# Altium project PROC091F.PrjPcb (part 1 of 6)
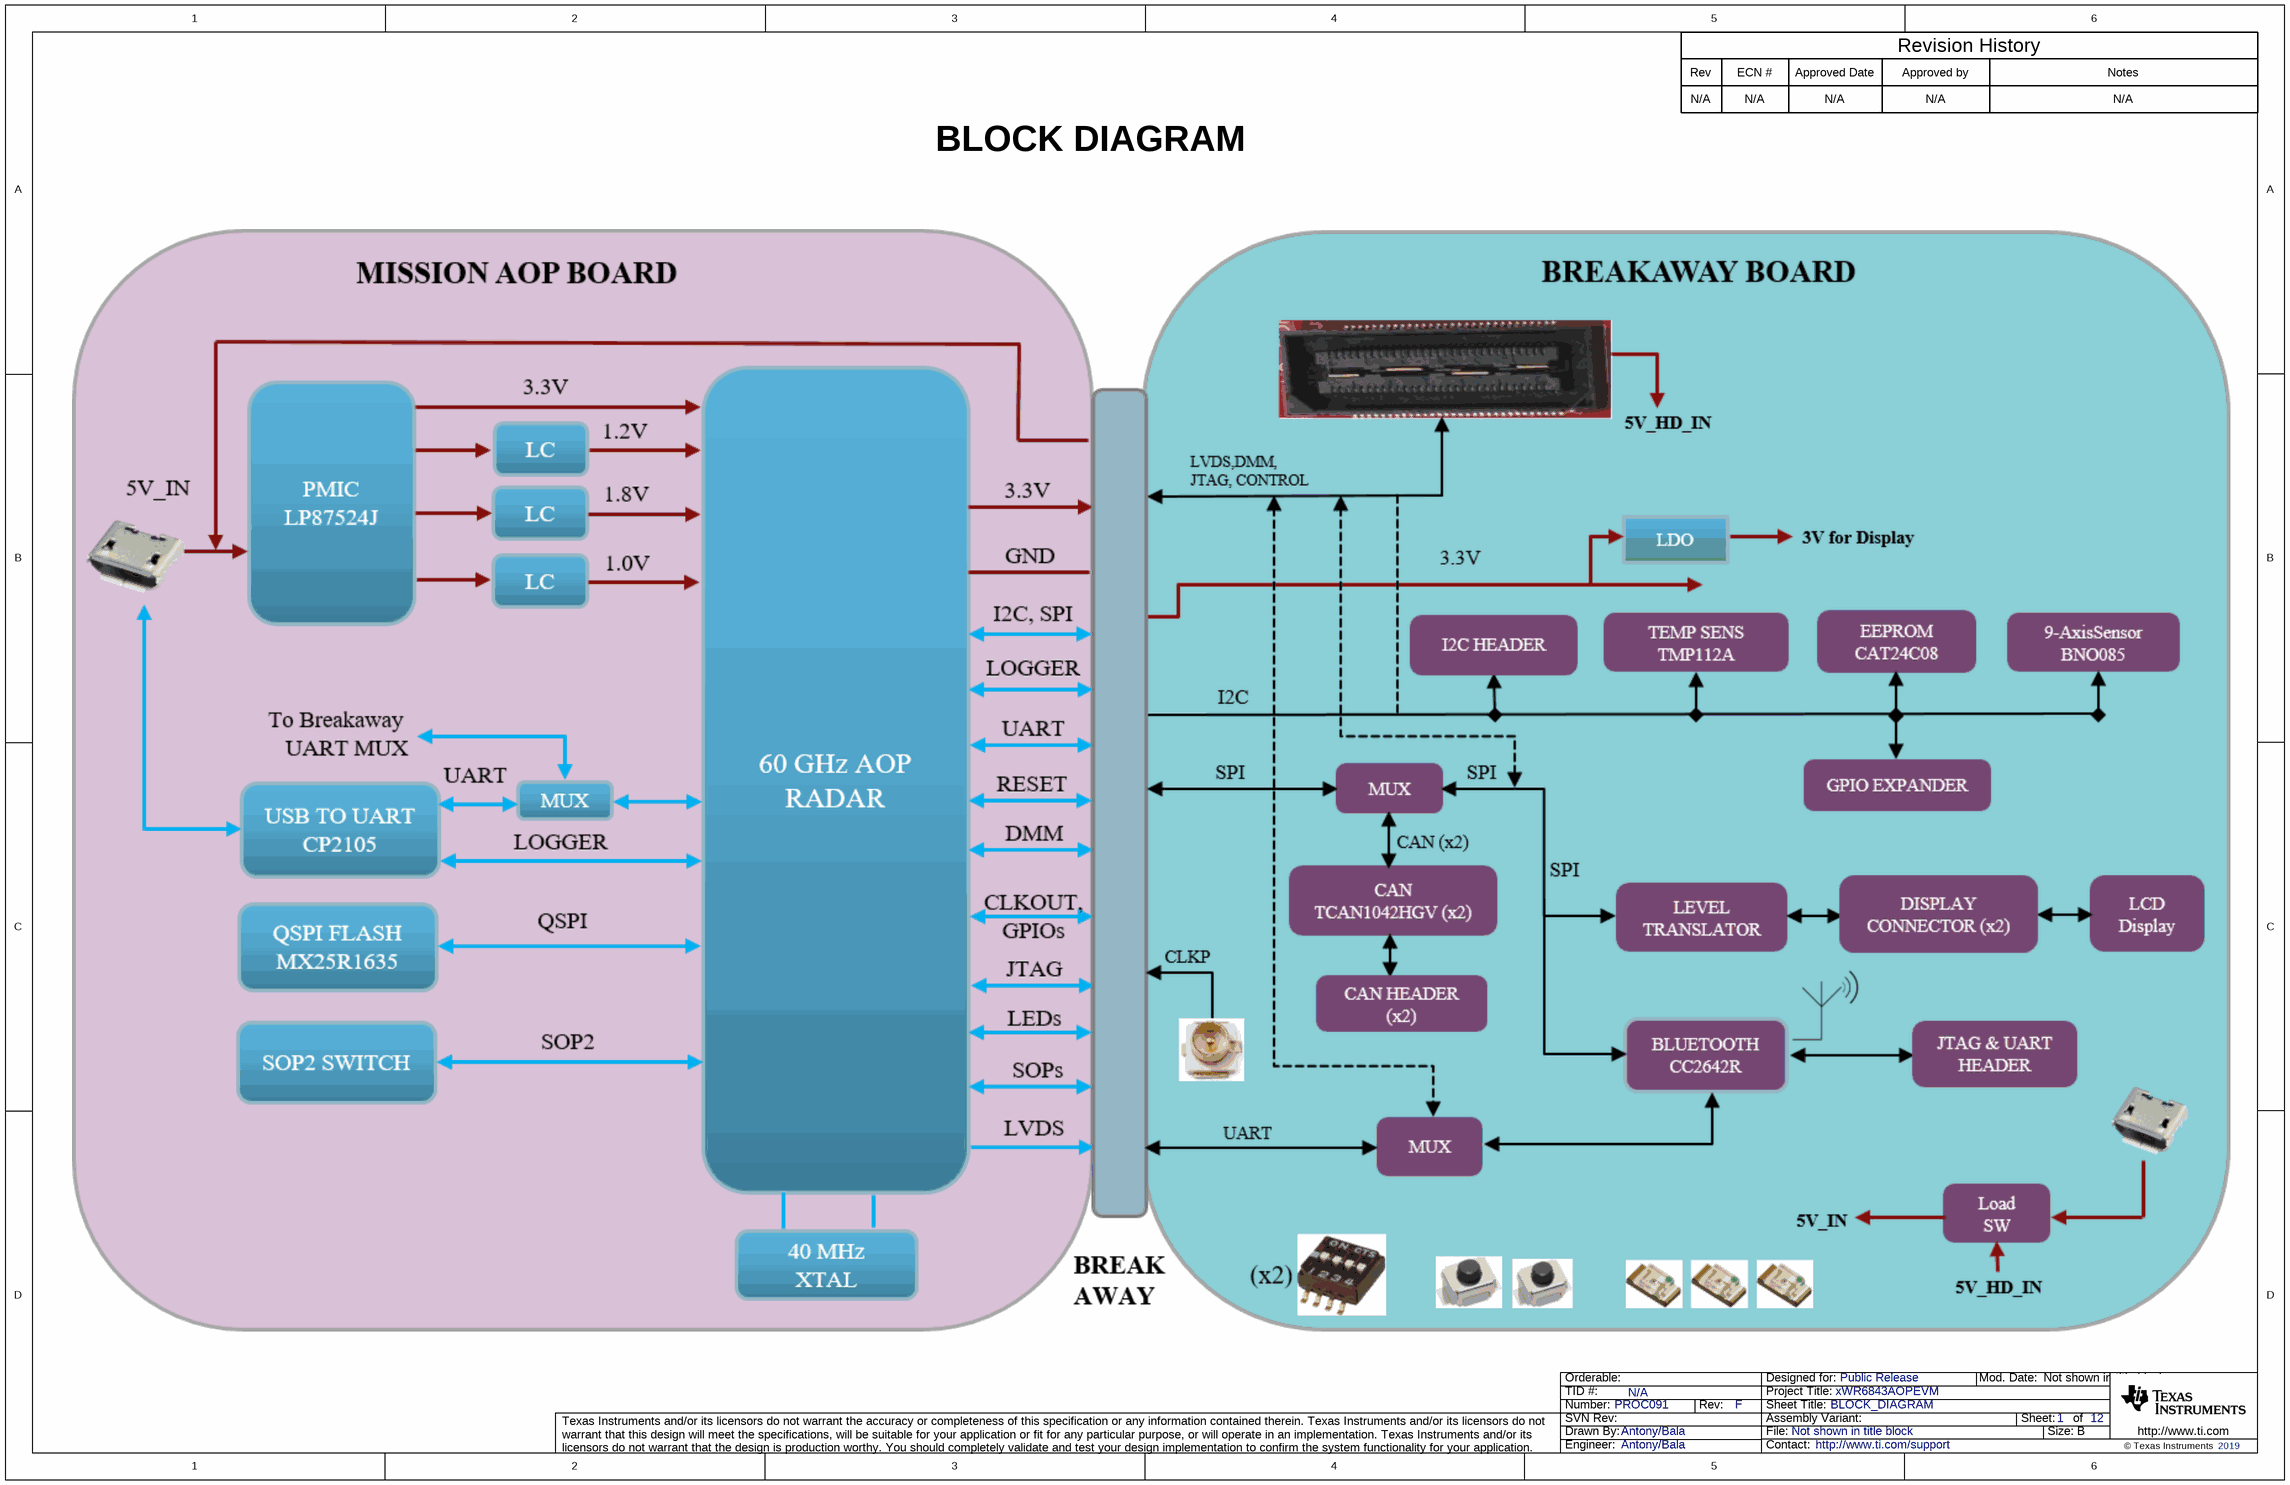
[diagram p0: PROC091F_BLOCK_DIAGRAM.SchDoc]
CopyrightYear: 2019; PCB_Layout: Mistral Team; PCB_Rev: F; PRJ_Customer: Public Release; PRJ_Engineer: Antony/Bala; PRJ_Number: PROC091; PRJ_Title: xWR6843AOPEVM; SCH_Rev: F; TechSupport: http://www.ti.com/support; TID: N/A
12 sheets, 414 parts. Net scope: flat (ports and power ports of the same name join across sheets).
Board file: PROC091F.PcbDoc
Sheets:
  PROC091F_BLOCK_DIAGRAM.SchDoc
  PROC091F_TABLEOFCONTENTS.SchDoc
  PROC091F_AOP_IO.SchDoc
  PROC091F_AOP_PWR.SchDoc
  PROC091F_PMIC.SchDoc
  PROC091F_FLASH_USB_TO_UART.SchDoc
  PROC091F_HD_CONN_PWR_SW.SchDoc
  PROC091F_RST_GPIOs_I2C.SchDoc
  PROC091F_BT_DISPLAY.SchDoc
  PROC091F_ANALOG_MUX.SchDoc
  PROC091F_CAN_INTERFACE.SchDoc
  PROC091F_Hardware.schdoc

## Sheet PROC091F_BLOCK_DIAGRAM.SchDoc: BLOCK_DIAGRAM
size 431 x 279 mm; Date: Not shown in title block; ApprovedBy: Not shown in title block; CheckedBy: Not shown in title block; Author: Not shown in title block; CompanyName: Not shown in title block; DrawnBy: Antony/Bala; Engineer: Not shown in title block; Organization: Not shown in title block; Address1: Not shown in title block; Address2: Not shown in title block; Address3: Not shown in title block; Address4: Not shown in title block; DocumentNumber: 1; Revision: Use project parameter SCH_Rev; SheetNumber: 1; SheetTotal: 12; PageSetup: Record=PageOptions|CenterHorizontal=True|CenterVertical=True|PrintScale=1.00|XCorrection=1.00|YCorrection=1.00|PrintKind=0|BorderSize=5000000|LeftOffset=0|BottomOffset=0|Orientation=2|PaperLength=1000|PaperWidth=1000|Scale=100|PaperSource=15|PrintQuality=600|MediaType=1|DitherType=10|PaperKind=Letter|PrintScaleMode=1; CurrentTime: Not shown in title block; CurrentDate: Not shown in title block; Time: Not shown in title block; DocumentFullPathAndName: Not shown in title block; DocumentName: Not shown in title block; ModifiedDate: Not shown in title block; ImagePath: Not shown in title block

### Notes on the sheet
- Rev
- N/A
- ECN #
- Approved Date
- Approved by
- Revision History
- Notes
- BLOCK DIAGRAM
- Drawn By:
- SVN Rev:
- Number:
- TID #:
- Orderable:
- Rev:
- Sheet Title:
- File:
- Project Title:
- Designed for:
- Assembly Variant:
- Mod. Date:
- Sheet:
- Size:
- of
- B
- http://www.ti.com
- Texas Instruments and/or its licensors do not warrant the accuracy or completeness of this specification or any information contained therein. Texas Instruments and/or its licensors do not warrant that this design will meet the specifications, will be suitable for your application or fit for any particular purpose, or will operate in an implementation. Texas Instruments and/or its licensors do not warrant that the design is production worthy. You should completely validate and test your design implementation to confirm the system functionality for your application.
- Engineer:
- Contact:
- © Texas Instruments

## Sheet PROC091F_TABLEOFCONTENTS.SchDoc: TABLE_OF_CONTENTS
size 431 x 279 mm; Date: Not shown in title block; ApprovedBy: Not shown in title block; CheckedBy: Not shown in title block; Author: Not shown in title block; CompanyName: Not shown in title block; DrawnBy: Antony/Bala; Engineer: Not shown in title block; Organization: Not shown in title block; Address1: Not shown in title block; Address2: Not shown in title block; Address3: Not shown in title block; Address4: Not shown in title block; DocumentNumber: 2; Revision: Use project parameter SCH_Rev; SheetNumber: 2; SheetTotal: 12; PageSetup: Record=PageOptions|CenterHorizontal=True|CenterVertical=True|PrintScale=1.00|XCorrection=1.00|YCorrection=1.00|PrintKind=0|BorderSize=5000000|LeftOffset=0|BottomOffset=0|Orientation=2|PaperLength=1000|PaperWidth=1000|Scale=100|PaperSource=15|PrintQuality=600|MediaType=1|DitherType=10|PaperKind=Letter|PrintScaleMode=1; CurrentTime: Not shown in title block; CurrentDate: Not shown in title block; Time: Not shown in title block; DocumentFullPathAndName: Not shown in title block; DocumentName: Not shown in title block; ModifiedDate: Not shown in title block; ImagePath: Not shown in title block
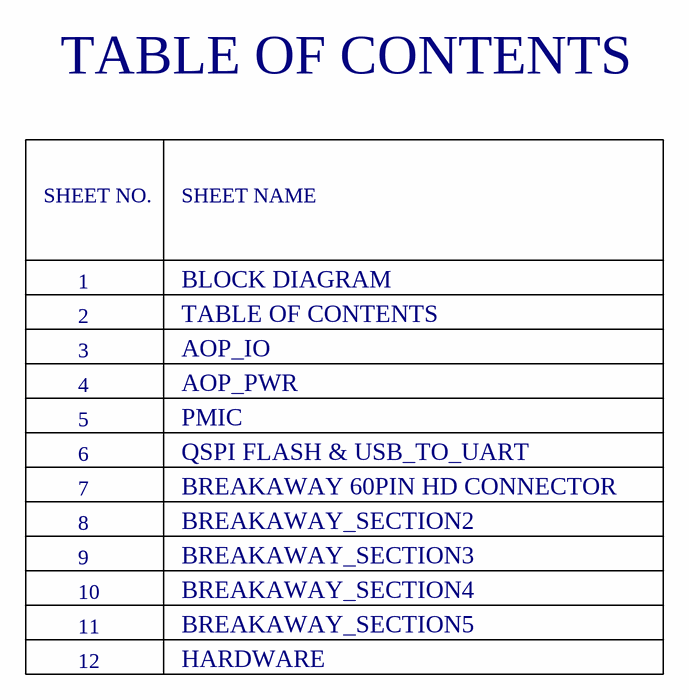
[diagram p1: PROC091F_TABLEOFCONTENTS.SchDoc]

### Notes on the sheet
- TABLE OF CONTENTS
- SHEET NO.
- SHEET NAME
- 1
- 2
- 3
- BLOCK DIAGRAM
- AOP_IO
- 4
- 5
- AOP_PWR
- PMIC
- 7
- 8
- 6
- QSPI FLASH & USB_TO_UART
- BREAKAWAY 60PIN HD CONNECTOR
- BREAKAWAY_SECTION2
- 9
- 10
- BREAKAWAY_SECTION3
- BREAKAWAY_SECTION4
- 11
- 12
- HARDWARE
- BREAKAWAY_SECTION5
- Drawn By:
- SVN Rev:
- Number:
- TID #:
- Orderable:
- Rev:
- Sheet Title:
- File:
- Project Title:
- Designed for:
- Assembly Variant:
- Mod. Date:
- Sheet:
- Size:
- of
- B
- http://www.ti.com
- Texas Instruments and/or its licensors do not warrant the accuracy or completeness of this specification or any information contained therein. Texas Instruments and/or its licensors do not warrant that this design will meet the specifications, will be suitable for your application or fit for any particular purpose, or will operate in an implementation. Texas Instruments and/or its licensors do not warrant that the design is production worthy. You should completely validate and test your design implementation to confirm the system functionality for your application.
- Engineer:
- Contact:
- © Texas Instruments

## Sheet PROC091F_AOP_IO.SchDoc: AOP_IO
size 431 x 279 mm; Date: Not shown in title block; ApprovedBy: Not shown in title block; CheckedBy: Not shown in title block; Author: Not shown in title block; CompanyName: Not shown in title block; DrawnBy: Antony/Bala; Engineer: Not shown in title block; Organization: Not shown in title block; Address1: Not shown in title block; Address2: Not shown in title block; Address3: Not shown in title block; Address4: Not shown in title block; DocumentNumber: 3; Revision: Use project parameter SCH_Rev; SheetNumber: 3; SheetTotal: 12; PageSetup: Record=PageOptions|CenterHorizontal=True|CenterVertical=True|PrintScale=1.00|XCorrection=1.00|YCorrection=1.00|PrintKind=0|BorderSize=5000000|LeftOffset=0|BottomOffset=0|Orientation=2|PaperLength=1000|PaperWidth=1000|Scale=100|PaperSource=15|PrintQuality=600|MediaType=1|DitherType=10|PaperKind=Letter|PrintScaleMode=1; CurrentTime: Not shown in title block; CurrentDate: Not shown in title block; Time: Not shown in title block; DocumentFullPathAndName: Not shown in title block; DocumentName: Not shown in title block; ModifiedDate: Not shown in title block; ImagePath: Not shown in title block
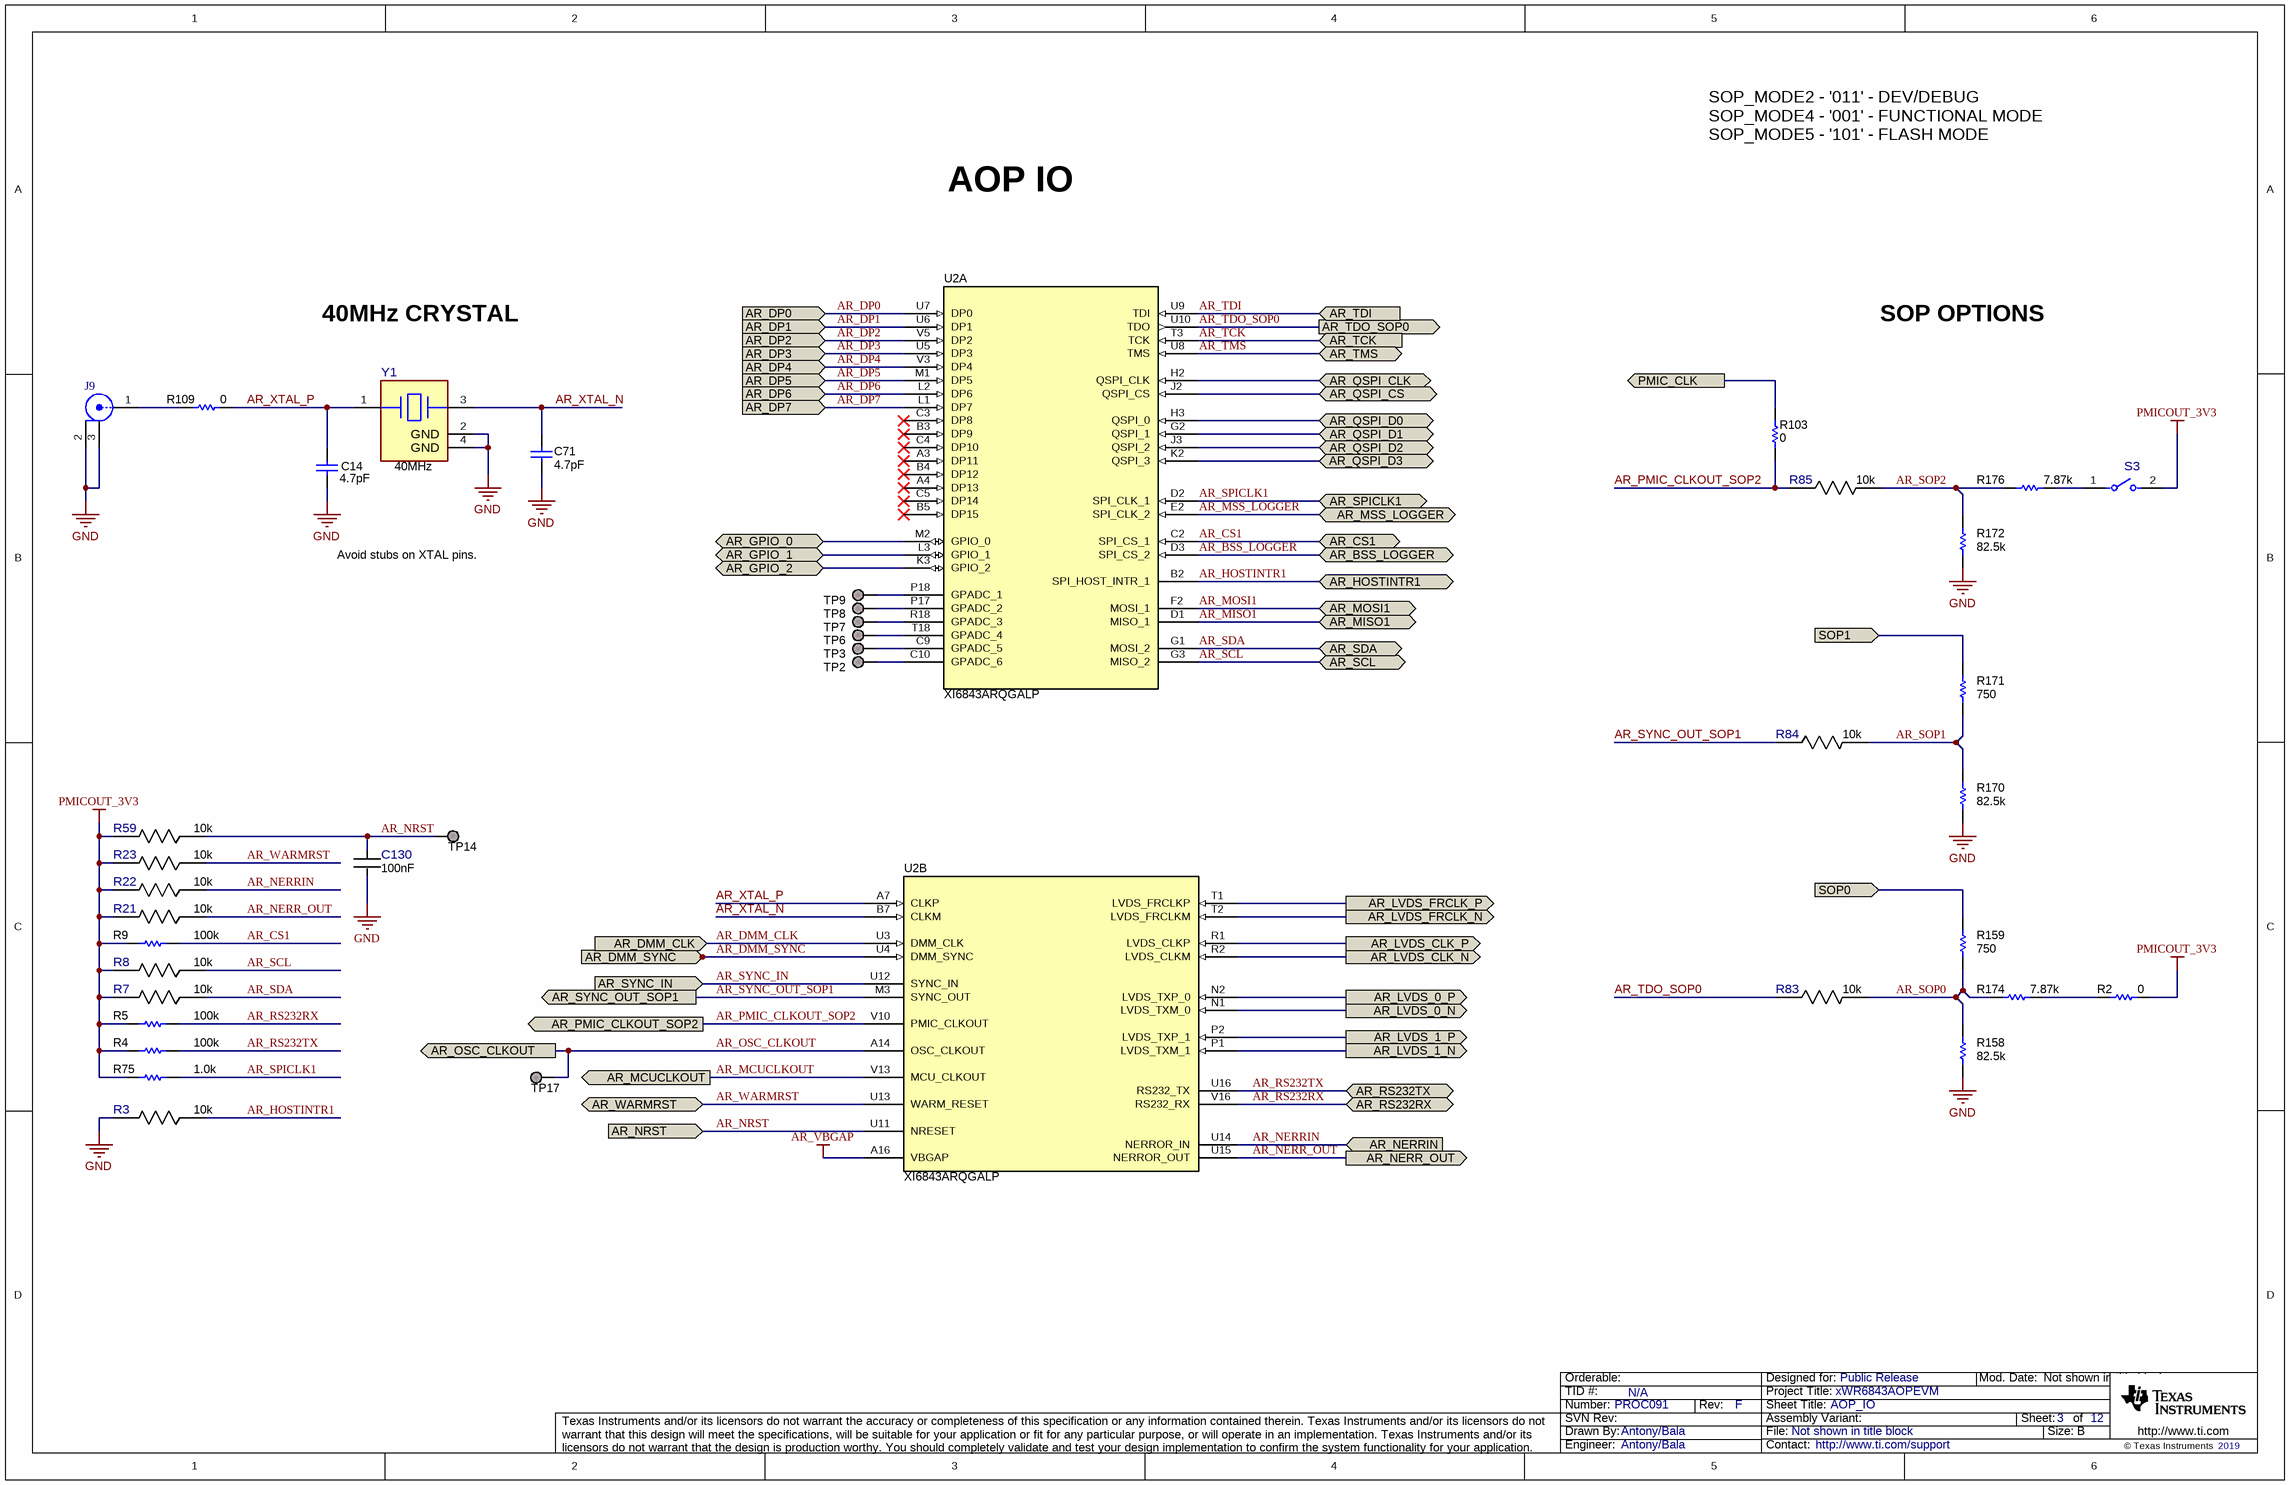
[diagram p2: PROC091F_AOP_IO.SchDoc]

### Parts
C14  value 4.7pF  [0201_033L]  (hidden comment: GRM0335C1H4R7BA01D)
C71  value 4.7pF  [0201_033L]  (hidden comment: GRM0335C1H4R7BA01D)
C130  Cap_F: 100nF  [FP-GRM033R6YA104KE14D_0201 (0603 Metric)-IPC_C]  (hidden comment: GRM033R6YA104KE14D)
J9  U.FL-R-SMT-1(01)  [CONN_UFL-R-SMT-1]  (value not drawn)
R2  Res_ohm: 0  [FP-RC0201JR-070RL_0201 (0603 Metric)-MFG]  (hidden comment: RC0201JR-070RL)
R3  Res_ohm: 10k  [FP-RR0306P-103-D_0201-IPC_C]  (hidden comment: RR0306P-103-D)
R4  value 100k  [0201L]  (hidden comment: CRCW0201100KFKED)
R5  value 100k  [0201L]  (hidden comment: CRCW0201100KFKED)
R7  Res_ohm: 10k  [FP-RR0306P-103-D_0201-IPC_C]  (hidden comment: RR0306P-103-D)
R8  Res_ohm: 10k  [FP-RR0306P-103-D_0201-IPC_C]  (hidden comment: RR0306P-103-D)
R9  value 100k  [0201L]  (hidden comment: CRCW0201100KFKED)
R21  Res_ohm: 10k  [FP-RR0306P-103-D_0201-IPC_C]  (hidden comment: RR0306P-103-D)
R22  Res_ohm: 10k  [FP-RR0306P-103-D_0201-IPC_C]  (hidden comment: RR0306P-103-D)
R23  Res_ohm: 10k  [FP-RR0306P-103-D_0201-IPC_C]  (hidden comment: RR0306P-103-D)
R59  Res_ohm: 10k  [FP-RR0306P-103-D_0201-IPC_C]  (hidden comment: RR0306P-103-D)
R75  value 1.0k  [0201L]  (hidden comment: RC0201JR-071KL)
R83  Res_ohm: 10k  [FP-RR0306P-103-D_0201-IPC_C]  (hidden comment: RR0306P-103-D)
R84  Res_ohm: 10k  [FP-RR0306P-103-D_0201-IPC_C]  (hidden comment: RR0306P-103-D)
R85  Res_ohm: 10k  [FP-RR0306P-103-D_0201-IPC_C]  (hidden comment: RR0306P-103-D)
R103  Res_ohm: 0  [FP-RC0201JR-070RL_0201 (0603 Metric)-IPC_C]  (hidden comment: RC0201JR-070RL)
R109  Res_ohm: 0  [FP-RC0201JR-070RL_0201 (0603 Metric)-MFG]  (hidden comment: RC0201JR-070RL)
R158  value 82.5k  [0201L]  (hidden comment: RC0201FR-0782K5L)
R159  value 750  [0201L]  (hidden comment: RC0201JR-07750RL)
R170  value 82.5k  [0201L]  (hidden comment: RC0201FR-0782K5L)
R171  value 750  [0201L]  (hidden comment: RC0201JR-07750RL)
R172  value 82.5k  [0201L]  (hidden comment: RC0201FR-0782K5L)
R174  value 7.87k  [0201L]  (hidden comment: RC0201FR-077K87L)
R176  value 7.87k  [0201L]  (hidden comment: RC0201FR-077K87L)
S3  CHS-01TA  [FP-CHS-01TA_SMT_SW_5MM4_2MM5-MFG]  (value not drawn)
TP2  TESTPOINT  [TP_25MIL-SMT]  (value not drawn)  (no BOM)
TP3  TESTPOINT  [TP_25MIL-SMT]  (value not drawn)  (no BOM)
TP6  TESTPOINT  [TP_25MIL-SMT]  (value not drawn)  (no BOM)
TP7  TESTPOINT  [TP_25MIL-SMT]  (value not drawn)  (no BOM)
TP8  TESTPOINT  [TP_25MIL-SMT]  (value not drawn)  (no BOM)
TP9  TESTPOINT  [TP_25MIL-SMT]  (value not drawn)  (no BOM)
TP14  TESTPOINT  [TP_25MIL-SMT]  (value not drawn)  (no BOM)
TP17  TESTPOINT  [TP_25MIL-SMT]  (value not drawn)  (no BOM)
U2  XI6843ARQGALP  [ALP0180A]  (parts A,B of 4)
Y1  Frequency_Fixed: 40MHz  [FP-CX2016DB40000D0FLJCC_SMT_2MM0_1MM6-MFG]  (hidden comment: CX2016DB40000D0FLJCC)

### Ports
AR_BSS_LOGGER (bidir), AR_CS1 (bidir), AR_DMM_CLK (in), AR_DMM_SYNC (in), AR_DP0 (in), AR_DP1 (in), AR_DP2 (in), AR_DP3 (in), AR_DP4 (in), AR_DP5 (in), AR_DP6 (in), AR_DP7 (in), AR_GPIO_0 (bidir), AR_GPIO_1 (bidir), AR_GPIO_2 (bidir), AR_HOSTINTR1 (bidir), AR_LVDS_0_N (out), AR_LVDS_0_P (out), AR_LVDS_1_N (out), AR_LVDS_1_P (out), AR_LVDS_CLK_N (out), AR_LVDS_CLK_P (out), AR_LVDS_FRCLK_N (out), AR_LVDS_FRCLK_P (out), AR_MCUCLKOUT (out), AR_MISO1 (bidir), AR_MOSI1 (bidir), AR_MSS_LOGGER (bidir), AR_NERR_OUT (out), AR_NERRIN (in), AR_NRST (in), AR_OSC_CLKOUT (out), AR_PMIC_CLKOUT_SOP2 (out), AR_QSPI_CLK (bidir), AR_QSPI_CS (bidir), AR_QSPI_D0 (bidir), AR_QSPI_D1 (bidir), AR_QSPI_D2 (bidir), AR_QSPI_D3 (bidir), AR_RS232RX (bidir), AR_RS232TX (bidir), AR_SCL (bidir), AR_SDA (bidir), AR_SPICLK1 (bidir), AR_SYNC_IN (in), AR_SYNC_OUT_SOP1 (out), AR_TCK (in), AR_TDI (in), AR_TDO_SOP0 (out), AR_TMS (bidir), AR_WARMRST (bidir), PMIC_CLK (out), SOP0 (in), SOP1 (in)

### Nets
AR_VBGAP: U2.A16(VBGAP)
GND: C14.1 C71.1 C130.2 J9.2 J9.3 R3.2 R158.1 R170.1 R172.1 Y1.2(GND) Y1.4(GND)
PMICOUT_3V3: R2.1 R4.1 R5.1 R7.2 R8.2 R9.1 R21.2 R22.2 R23.2 R59.2 R75.1 S3.2
AR_BSS_LOGGER: U2.D3(SPI_CS_2) ; port AR_BSS_LOGGER
AR_CS1: R9.2 U2.C2(SPI_CS_1) ; port AR_CS1
AR_DMM_CLK: U2.U3(DMM_CLK) ; port AR_DMM_CLK
AR_DMM_SYNC: U2.U4(DMM_SYNC) ; port AR_DMM_SYNC
AR_DP0: U2.U7(DP0) ; port AR_DP0
AR_DP1: U2.U6(DP1) ; port AR_DP1
AR_DP2: U2.V5(DP2) ; port AR_DP2
AR_DP3: U2.U5(DP3) ; port AR_DP3
AR_DP4: U2.V3(DP4) ; port AR_DP4
AR_DP5: U2.M1(DP5) ; port AR_DP5
AR_DP6: U2.L2(DP6) ; port AR_DP6
AR_DP7: U2.L1(DP7) ; port AR_DP7
AR_GPIO_0: U2.M2(GPIO_0) ; port AR_GPIO_0
AR_GPIO_1: U2.L3(GPIO_1) ; port AR_GPIO_1
AR_GPIO_2: U2.K3(GPIO_2) ; port AR_GPIO_2
AR_HOSTINTR1: R3.1 U2.B2(SPI_HOST_INTR_1) ; port AR_HOSTINTR1
AR_LVDS_0_N: U2.N1(LVDS_TXM_0) ; port AR_LVDS_0_N
AR_LVDS_0_P: U2.N2(LVDS_TXP_0) ; port AR_LVDS_0_P
AR_LVDS_1_N: U2.P1(LVDS_TXM_1) ; port AR_LVDS_1_N
AR_LVDS_1_P: U2.P2(LVDS_TXP_1) ; port AR_LVDS_1_P
AR_LVDS_CLK_N: U2.R2(LVDS_CLKM) ; port AR_LVDS_CLK_N
AR_LVDS_CLK_P: U2.R1(LVDS_CLKP) ; port AR_LVDS_CLK_P
AR_LVDS_FRCLK_N: U2.T2(LVDS_FRCLKM) ; port AR_LVDS_FRCLK_N
AR_LVDS_FRCLK_P: U2.T1(LVDS_FRCLKP) ; port AR_LVDS_FRCLK_P
AR_MCUCLKOUT: U2.V13(MCU_CLKOUT) ; port AR_MCUCLKOUT
AR_MISO1: U2.D1(MISO_1) ; port AR_MISO1
AR_MOSI1: U2.F2(MOSI_1) ; port AR_MOSI1
AR_MSS_LOGGER: U2.E2(SPI_CLK_2) ; port AR_MSS_LOGGER
AR_NERR_OUT: R21.1 U2.U15(NERROR_OUT) ; port AR_NERR_OUT
AR_NERRIN: R22.1 U2.U14(NERROR_IN) ; port AR_NERRIN
AR_NRST: C130.1 R59.1 TP14.1 U2.U11(NRESET) ; port AR_NRST
AR_OSC_CLKOUT: TP17.1 U2.A14(OSC_CLKOUT) ; port AR_OSC_CLKOUT
AR_PMIC_CLKOUT_SOP2: R85.1 R103.1 U2.V10(PMIC_CLKOUT) ; port AR_PMIC_CLKOUT_SOP2
AR_QSPI_CLK: U2.H2(QSPI_CLK) ; port AR_QSPI_CLK
AR_QSPI_CS: U2.J2(QSPI_CS) ; port AR_QSPI_CS
AR_QSPI_D0: U2.H3(QSPI_0) ; port AR_QSPI_D0
AR_QSPI_D1: U2.G2(QSPI_1) ; port AR_QSPI_D1
AR_QSPI_D2: U2.J3(QSPI_2) ; port AR_QSPI_D2
AR_QSPI_D3: U2.K2(QSPI_3) ; port AR_QSPI_D3
AR_RS232RX: R5.2 U2.V16(RS232_RX) ; port AR_RS232RX
AR_RS232TX: R4.2 U2.U16(RS232_TX) ; port AR_RS232TX
AR_SCL: R8.1 U2.G3(MISO_2) ; port AR_SCL
AR_SDA: R7.1 U2.G1(MOSI_2) ; port AR_SDA
AR_SOP0: R83.2 R158.2 R159.1 R174.2
AR_SOP1: R84.2 R170.2 R171.1
AR_SOP2: R85.2 R172.2 R176.2
AR_SPICLK1: R75.2 U2.D2(SPI_CLK_1) ; port AR_SPICLK1
AR_SYNC_IN: U2.U12(SYNC_IN) ; port AR_SYNC_IN
AR_SYNC_OUT_SOP1: R84.1 U2.M3(SYNC_OUT) ; port AR_SYNC_OUT_SOP1
AR_TCK: U2.T3(TCK) ; port AR_TCK
AR_TDI: U2.U9(TDI) ; port AR_TDI
AR_TDO_SOP0: R83.1 U2.U10(TDO) ; port AR_TDO_SOP0
AR_TMS: U2.U8(TMS) ; port AR_TMS
AR_WARMRST: R23.1 U2.U13(WARM_RESET) ; port AR_WARMRST
AR_XTAL_N: C71.2 U2.B7(CLKM) Y1.3
AR_XTAL_P: C14.2 R109.1 U2.A7(CLKP) Y1.1
PMIC_CLK: R103.2 ; port PMIC_CLK
SOP0: R159.2 ; port SOP0
SOP1: R171.2 ; port SOP1
NetJ9_1: J9.1 R109.2
NetR2_2: R2.2 R174.1
NetR176_1: R176.1 S3.1
NetTP2_1: TP2.1 U2.C10(GPADC_6)
NetTP3_1: TP3.1 U2.C9(GPADC_5)
NetTP6_1: TP6.1 U2.T18(GPADC_4)
NetTP7_1: TP7.1 U2.R18(GPADC_3)
NetTP8_1: TP8.1 U2.P17(GPADC_2)
NetTP9_1: TP9.1 U2.P18(GPADC_1)

Not connected (* = marked no-connect by the designer): U2 A3(DP11)* A4(DP13)* B3(DP9)* B4(DP12)* B5(DP15)* C3(DP8)* C4(DP10)* C5(DP14)*

### Notes on the sheet
- SOP_MODE2 - '011' - DEV/DEBUG
  SOP_MODE4 - '001' - FUNCTIONAL MODE
  SOP_MODE5 - '101' - FLASH MODE
- AOP IO
- 40MHz CRYSTAL
- SOP OPTIONS
- Avoid stubs on XTAL pins.
- Drawn By:
- SVN Rev:
- Number:
- TID #:
- Orderable:
- Rev:
- Sheet Title:
- File:
- Project Title:
- Designed for:
- Assembly Variant:
- Mod. Date:
- Sheet:
- Size:
- of
- B
- http://www.ti.com
- Texas Instruments and/or its licensors do not warrant the accuracy or completeness of this specification or any information contained therein. Texas Instruments and/or its licensors do not warrant that this design will meet the specifications, will be suitable for your application or fit for any particular purpose, or will operate in an implementation. Texas Instruments and/or its licensors do not warrant that the design is production worthy. You should completely validate and test your design implementation to confirm the system functionality for your application.
- Engineer:
- Contact:
- © Texas Instruments

### Library data of the parts
C14 C71 = CMP-0080076-1: CAP, CERM, 4.7 pF, 50 V,+/- 3%, C0G/NP0, 0201; Manufacturer: MuRata; AEC Category: Q200; AEC Qualified: N; Cap_Case: 0201; SizeArea_mm2: 0.18; SizeAreaWB_mm2: 2.08; SizeX_mm: 0.6; SizeY_mm: 0.3; SizeZ_mm: 0.33; TaMax_C: 125°C; TaMin_C: -55°C; U/M: EA; Value2: 50V; RoHS: Y; AEC Grade: N/A; Cap_F: 4.7pF; ComponentLink1Description: Datasheet link; ComponentLink1URL: https://search.murata.co.jp/Ceramy/image/img/A01X/G101/ENG/GRM0335C1H4R7BA01-01A.pdf; CompType: Capacitor; MountType: SMT; PackageReference: 0201; PartNumber: GRM0335C1H4R7BA01D; Polarized: N; Supplier 1: Digi-Key; Supplier 2: Mouser; Supplier Part Number 1: 490-11332-1-ND; Supplier Part Number 2: 81-GRM0335C1H4R7BA1D; Technology: Ceramic; TempCo: C0G/NP0; Tolerance_%: 3%; ValueDisplayed: 4.7pF; VDC_V: 50V
C130 = CMP-0086440-1: Cap Ceramic 0.1uF 35V X5R 10% Pad SMD 0201 85C T/R; Manufacturer: Murata Electronics North America; AEC Qualified: No; SizeZ_mm: 0.33mm; Symbol Name: SYM-GRM033R6YA104KE14D; TempCo: 15%; RoHS: TRUE; ComponentLink1Description: Datasheet; ComponentLink1URL: https://search.murata.co.jp/Ceramy/image/img/A01X/G101/ENG/GRM033R6YA104KE14-01.pdf; PackageReference: 0201 (0603 Metric); PartNumber: GRM033R6YA104KE14D; Tolerance_%: 10%; VDC_V: 35V
J9 = CMP-0075320-1: Receptacle, Ultra Miniature Coaxial, Male Pin, 50 ohm, SMT; Manufacturer: Hirose Electric Co. Ltd.; CNHeader: False; Gender: Female; ContactFinish: Gold; ComponentLink1URL: https://www.hirose.com/product/en/download_file/key_name/U.FL%2DR%2DSMT%2D1%2801%29/category/Drawing%20(2D)/doc_file_id/37625/?file_category_id=6&item_id=03310472201&is_series=; Supplier Part Number 2: 18K7517; Publisher: Texas Instruments; Supplier 2: Newark; Supplier Part Number 3: 798-U.FL-R-SMT01; Color: Beige; Supplier 3: Mouser; RoHS: Y; MountType: SMT; Supplier 1: Digi-Key; PackageReference: Ultra small CO-AX SMD; PinCount: 3; CompType: Receptacle; LatestRevisionDate: 2017-07-12; PartNumber: U.FL-R-SMT-1(01); Orientation: Vertical; ComponentLink1Description: Datasheet URL; Supplier Part Number 1: H122041-ND; CT: False
R2 R103 R109 = CMP-0086442-2: RES SMD 0 OHM JUMPER 1/20W 0201; Manufacturer: Yageo; AEC Qualified: No; Power_W: 50mW; SizeZ_mm: 0.26mm; TempCo: 200ppm/°C; Tolerance_%: 5%; VDC_V: 25V; RoHS: TRUE; ComponentLink1Description: Datasheet; ComponentLink1URL: http://www.yageo.com/documents/recent/PYu-RC_Group_51_RoHS_L_10.pdf; PackageReference: 0201 (0603 Metric); PartNumber: RC0201JR-070RL; Technology: Thick Film
R3 R7 R8 R21-R23 R59 R83-R85 = CMP-0088002-1: 10 kOhms ±0.5% 0.05W, 1/20W Chip Resistor 0201 (0603 Metric)  Thin Film; Manufacturer: Susumu; AEC Qualified: No; Power_W: 50mW; SizeZ_mm: 0.26mm; Symbol Name: SYM-RR0306P-103-D; TempCo: 25ppm/°C; VDC_V: 15V; RoHS: TRUE; ComponentLink1Description: Datasheet; ComponentLink1URL: https://www.susumu.co.jp/common/pdf/n_catalog_partition05_en.pdf; PackageReference: 0201; PartNumber: RR0306P-103-D; Technology: Thin Film; Tolerance_%: 0.5%
R4 R5 R9 = CMP-0027261-3: RES, 100 k, 1%, 0.05 W, 0201; Manufacturer: Vishay-Dale; AEC Category: Q200; AEC Qualified: N; EIA_Code: E96; Power_W: 50mW; SizeArea_mm2: 0.18; SizeX_mm: 0.6; SizeY_mm: 0.3; SizeZ_mm: 0.26; TempCo: 100 ppm/C; Value2: 0.05W; VDC_V: 30V; RoHS: E; AEC Grade: N/A; ComponentLink1Description: Datasheet link; ComponentLink1URL: http://www.vishay.com/docs/20052/crcw0201e3.pdf; CompType: Resistor; MountType: SMT; PackageReference: 0201; PartNumber: CRCW0201100KFKED; Res_ohm: 100k; Supplier 1: Digi-Key; Supplier 2: Newark; Supplier 3: Mouser; Supplier Part Number 1: 541-100KAABCT-ND; Supplier Part Number 2: 84R1457; Supplier Part Number 3: 71-CRCW0201100KFKED; Technology: Thick Film; Tolerance_%: 1%; Value1: 1%; Value_Code: 100k; ValueDisplayed: 100k
R75 = CMP-0027052-1: RES, 1.0 k, 5%, 0.05 W, 0201; Manufacturer: Yageo America; AEC Category: Q200; AEC Qualified: N; EIA_Code: E24; Power_W: 50mW; Res_ohm: 1k; SizeArea_mm2: 0.18; SizeX_mm: 0.6; SizeY_mm: 0.3; SizeZ_mm: 0.26; TempCo: 200 ppm/C; U/M: EA; Value2: 0.05W; Value_Code: 1k00; VDC_V: 25V; RoHS: Y; AEC Grade: N/A; ComponentLink1Description: Datasheet link; ComponentLink1URL: http://www.yageo.com/documents/recent/PYu-RC_Group_51_RoHS_L_5.pdf; CompType: Resistor; LatestRevisionDate: 2017-03-09; MountType: SMT; PackageReference: 0201; PartNumber: RC0201JR-071KL; Published: 2016-10-14; Publisher: Texas Instruments; Supplier 1: Digi-Key; Supplier 2: Mouser; Supplier Part Number 1: 311-1KNCT-ND; Supplier Part Number 2: 603-RC0201JR-071KL; Technology: Thick Film; Tolerance_%: 5%; Value1: 5%; ValueDisplayed: 1.0k
R158 R170 R172 = CMP-0027891-1: RES, 82.5 k, 1%, 0.05 W, 0201; Manufacturer: Yageo America; AEC Category: Q200; AEC Qualified: N; EIA_Code: E96; Power_W: 50mW; SizeArea_mm2: 0.18; SizeX_mm: 0.6; SizeY_mm: 0.3; SizeZ_mm: 0.26; TempCo: 200 ppm/C; U/M: EA; Value2: 0.05W; Value_Code: 82k5; VDC_V: 25V; RoHS: Y; AEC Grade: N/A; ComponentLink1Description: Datasheet link; ComponentLink1URL: http://www.yageo.com/documents/recent/PYu-RC_Group_51_RoHS_L_5.pdf; CompType: Resistor; LatestRevisionDate: 2017-03-09; MountType: SMT; PackageReference: 0201; PartNumber: RC0201FR-0782K5L; Published: 2016-10-14; Publisher: Texas Instruments; Res_ohm: 82.5k; Supplier 1: Digi-Key; Supplier 2: Mouser; Supplier Part Number 1: YAG2815CT-ND; Supplier Part Number 2: 603-RC0201FR-0782K5L; Technology: Thick Film; Tolerance_%: 1%; Value1: 1%; ValueDisplayed: 82.5k
R159 R171 = CMP-0027165-1: RES, 750, 5%, 0.05 W, 0201; Manufacturer: Yageo America; AEC Category: Q200; AEC Qualified: N; EIA_Code: E24; Power_W: 50mW; SizeArea_mm2: 0.18; SizeX_mm: 0.6; SizeY_mm: 0.3; SizeZ_mm: 0.26; TempCo: 200 ppm/C; U/M: EA; Value2: 0.05W; Value_Code: 750R; VDC_V: 25V; RoHS: Y; AEC Grade: N/A; ComponentLink1Description: Datasheet link; ComponentLink1URL: http://www.yageo.com/documents/recent/PYu-RC_Group_51_RoHS_L_5.pdf; CompType: Resistor; LatestRevisionDate: 2017-03-09; MountType: SMT; PackageReference: 0201; PartNumber: RC0201JR-07750RL; Published: 2016-10-14; Publisher: Texas Instruments; Res_ohm: 750; Supplier 1: Digi-Key; Supplier 2: Mouser; Supplier Part Number 1: YAG2927CT-ND; Supplier Part Number 2: 603-RC0201JR-07750RL; Technology: Thick Film; Tolerance_%: 5%; Value1: 5%; ValueDisplayed: 750
R174 R176 = CMP-0027880-1: RES, 7.87 k, 1%, 0.05 W, 0201; Manufacturer: Yageo America; AEC Category: Q200; AEC Qualified: N; EIA_Code: E96; Power_W: 50mW; SizeArea_mm2: 0.18; SizeX_mm: 0.6; SizeY_mm: 0.3; SizeZ_mm: 0.26; TempCo: 200 ppm/C; U/M: EA; Value2: 0.05W; Value_Code: 7k87; VDC_V: 25V; RoHS: Y; AEC Grade: N/A; ComponentLink1Description: Datasheet link; ComponentLink1URL: http://www.yageo.com/documents/recent/PYu-RC_Group_51_RoHS_L_5.pdf; CompType: Resistor; LatestRevisionDate: 2017-03-09; MountType: SMT; PackageReference: 0201; PartNumber: RC0201FR-077K87L; Published: 2016-10-14; Publisher: Texas Instruments; Res_ohm: 7.87k; Supplier 1: Digi-Key; Supplier 2: Mouser; Supplier Part Number 1: YAG2807CT-ND; Supplier Part Number 2: 603-RC0201FR-077K87L; Technology: Thick Film; Tolerance_%: 1%; Value1: 1%; ValueDisplayed: 7.87k
S3 = CMP-0087181-1: SWITCH SLIDE DIP SPST 100MA 6V; Manufacturer: Nidec Copal Electronics; PositionCount: 1; SizeZ_mm: 2.5mm; Symbol Name: SYM-CHS-01TA; RoHS: TRUE; Circuit: SPST; ComponentLink1Description: Datasheet; ComponentLink1URL: https://www.nidec-copal-electronics.com/e/catalog/switch/chs.pdf; MountType: Surface Mount; PackageReference: SMT_SW_5MM4_2MM5; PartNumber: CHS-01TA; VDC_V: 6V
TP2 TP3 TP6-TP9 TP14 TP17 = CMP-0078143-3: TEST POINT.  No entry in BOM.; CompType: Testpoint; Manufacturer: N/A; PackageReference: N/A; PartNumber: N/A; Library Reference: TESTPOINT
U2 = CMP-0860942-2: XI6843ARQGALP, ALP0180A (BGA-180); Manufacturer: Texas Instruments; SizeZ_mm: 0.965; SizeX_mm: 15; AEC Qualified: N; SizeArea_mm2: 225; SizeAreaWB_mm2: 289; CompType: IC; AEC Category: Q200; MountType: SMT; ComponentLink2URL: http://www.ti.com/product/xi6843arqg; Alternate Manufacturer: Texas Instruments; ComponentLink2Description: Product Folder; ComponentLink3Description: Online Datasheet; PackageReference: ALP0180A; ComponentLink1URL: http://www.ti.com/lit/ds/symlink/xi6843arqg.pdf; PartNumber: XI6843ARQGALP; PackageDescription: BGA-180; ComponentLink1Description: Datasheet Link; ComponentLink3URL: http://www.ti.com/product/xi6843arqg/datasheet; SizeY_mm: 15
Y1 = CMP-0087164-1: CRYSTAL 40.0000MHZ 8PF SMD; Manufacturer: Kyocera International Inc. Electronic Components; AEC Qualified: No; Frequency Stability: 15ppm; SizeZ_mm: 0.45mm; RoHS: TRUE; ComponentLink1Description: Datasheet; ComponentLink1URL: https://global.kyocera.com/prdct/electro/product/pdf/cx2016db_e.pdf; Frequency Tolerance: 15ppm; Load Capacitance: 8pF; PackageReference: SMT_2MM0_1MM6; PartNumber: CX2016DB40000D0FLJCC; Symbol Name: SYM-CX2016DB40000D0FLJCC

## Sheet PROC091F_AOP_PWR.SchDoc: AOP_POWER
size 431 x 279 mm; Date: Not shown in title block; ApprovedBy: Not shown in title block; CheckedBy: Not shown in title block; Author: Not shown in title block; CompanyName: Not shown in title block; DrawnBy: Antony/Bala; Engineer: Not shown in title block; Organization: Not shown in title block; Address1: Not shown in title block; Address2: Not shown in title block; Address3: Not shown in title block; Address4: Not shown in title block; DocumentNumber: 4; Revision: Use project parameter SCH_Rev; SheetNumber: 4; SheetTotal: 12; PageSetup: Record=PageOptions|CenterHorizontal=True|CenterVertical=True|PrintScale=1.00|XCorrection=1.00|YCorrection=1.00|PrintKind=0|BorderSize=5000000|LeftOffset=0|BottomOffset=0|Orientation=2|PaperLength=1000|PaperWidth=1000|Scale=100|PaperSource=15|PrintQuality=600|MediaType=1|DitherType=10|PaperKind=Letter|PrintScaleMode=1; CurrentTime: Not shown in title block; CurrentDate: Not shown in title block; Time: Not shown in title block; DocumentFullPathAndName: Not shown in title block; DocumentName: Not shown in title block; ModifiedDate: Not shown in title block; ImagePath: Not shown in title block
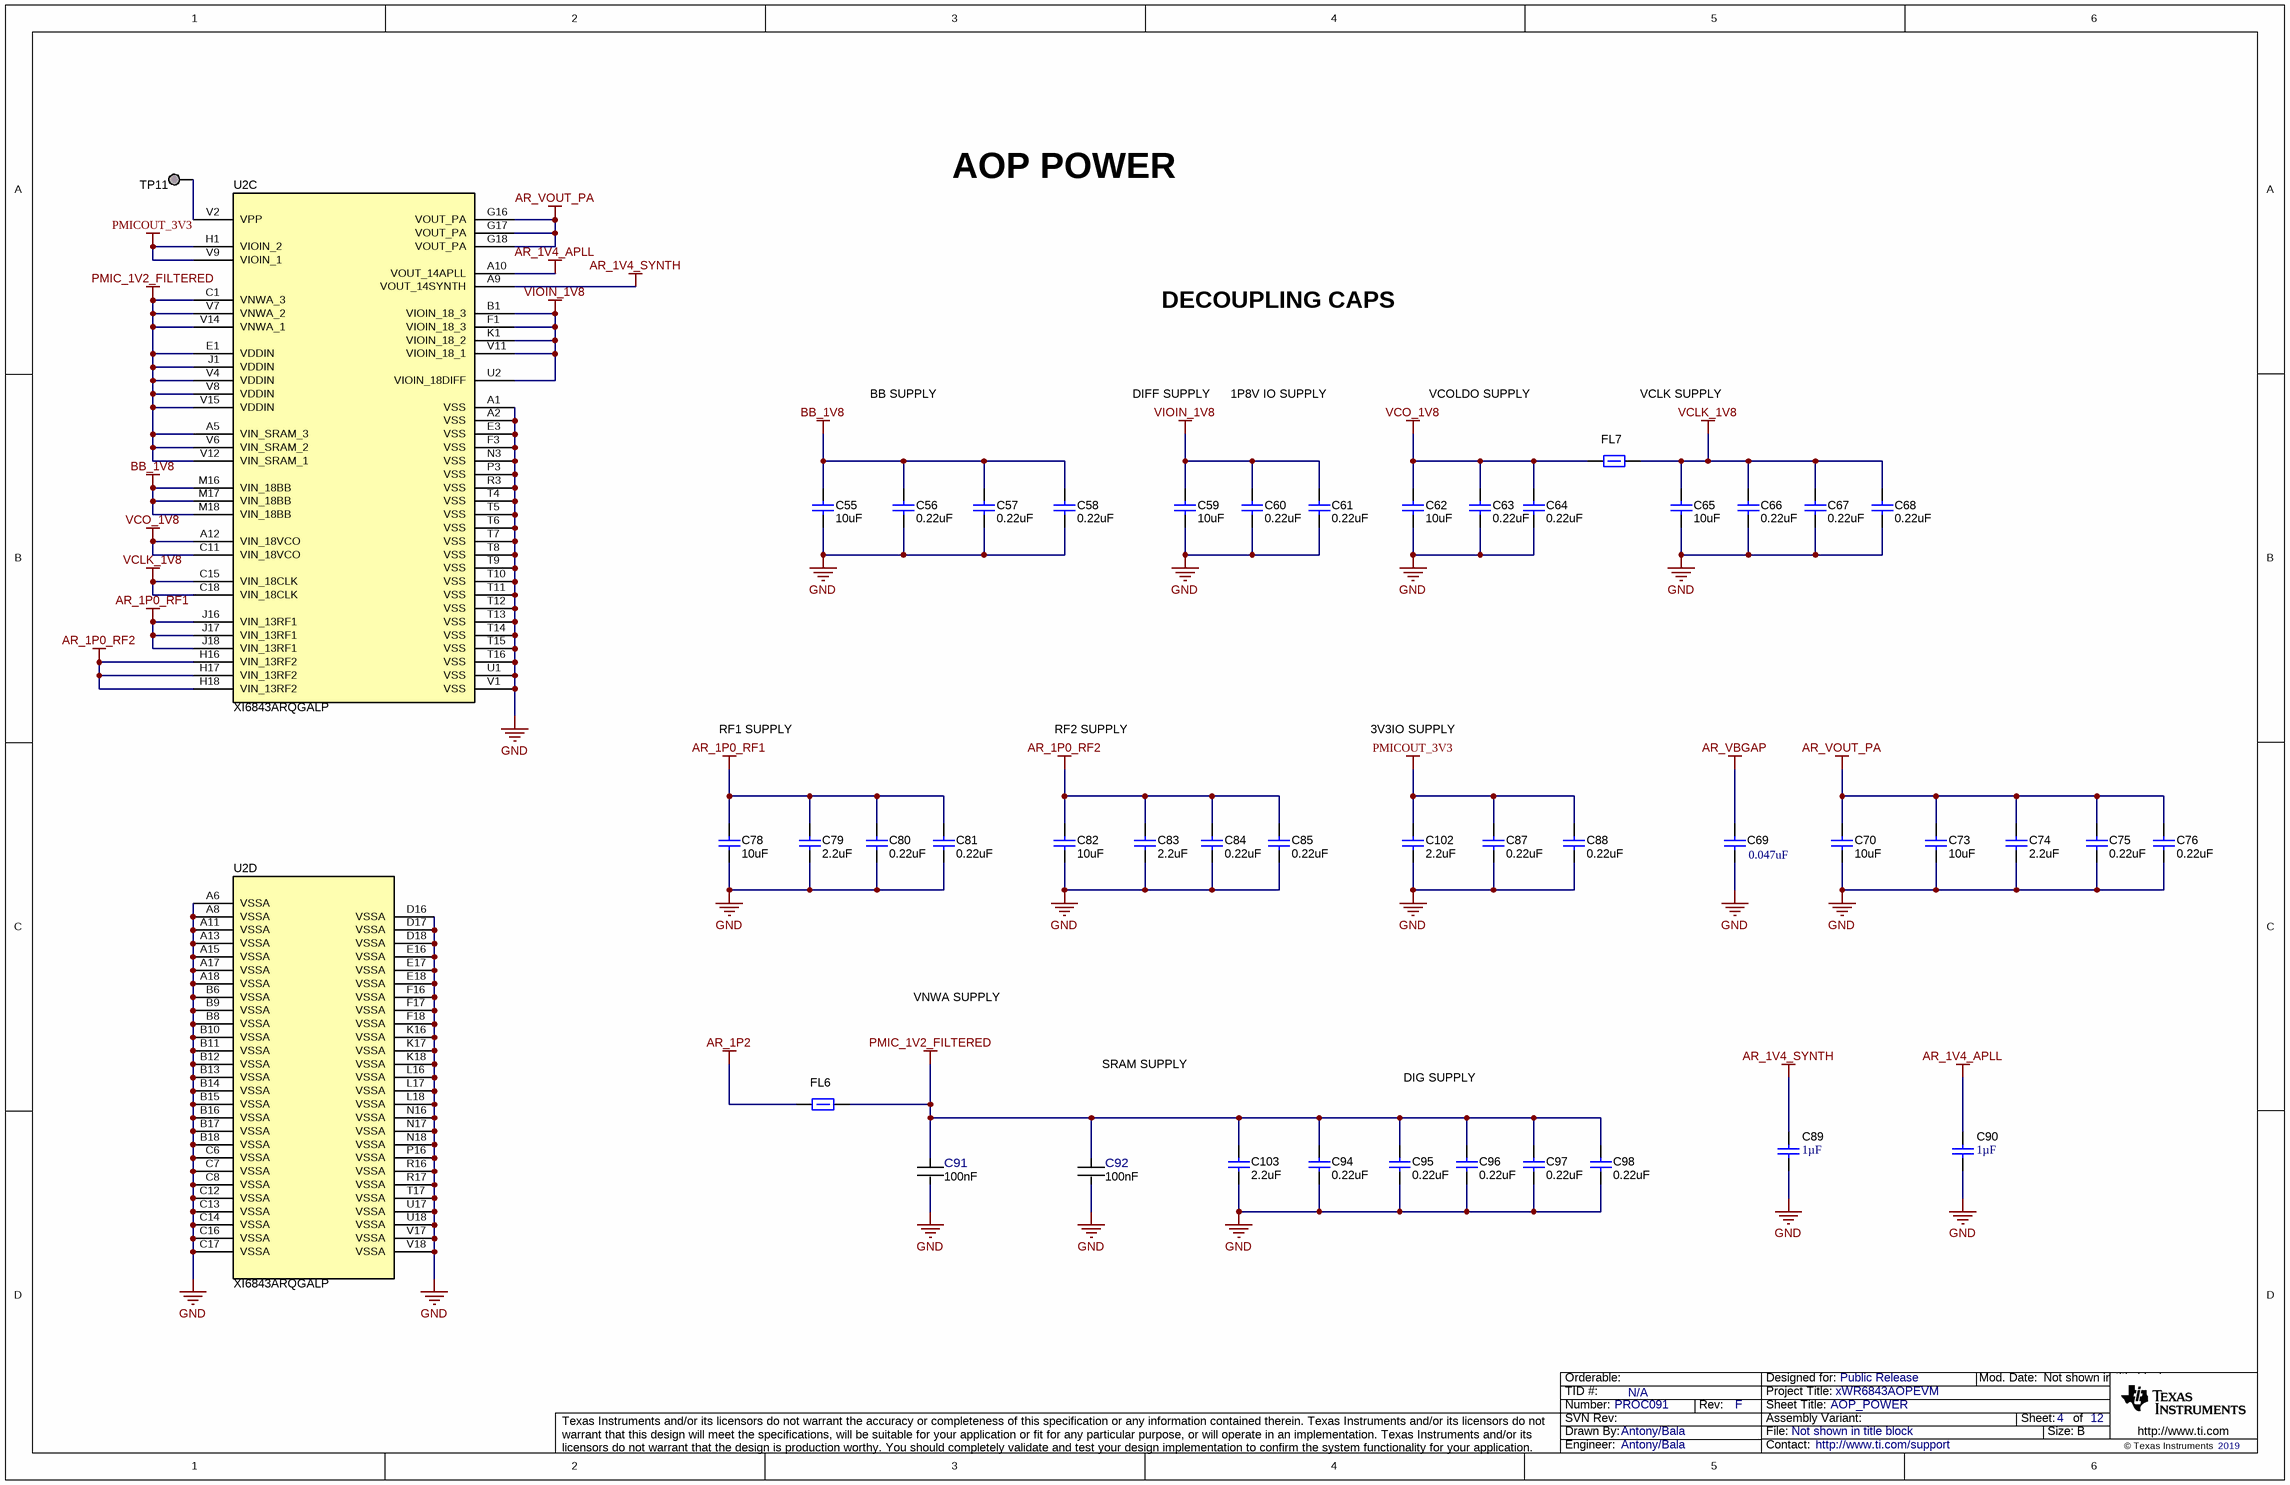
[diagram p3: PROC091F_AOP_PWR.SchDoc]

### Parts
C55  value 10uF  [0402_070]  (hidden comment: CL05A106MP5NUNC)
C56  value 0.22uF  [0201_033L]  (hidden comment: LMK063BJ224MP-F)
C57  value 0.22uF  [0201_033L]  (hidden comment: LMK063BJ224MP-F)
C58  value 0.22uF  [0201_033L]  (hidden comment: LMK063BJ224MP-F)
C59  value 10uF  [0402_070]  (hidden comment: CL05A106MP5NUNC)
C60  value 0.22uF  [0201_033L]  (hidden comment: LMK063BJ224MP-F)
C61  value 0.22uF  [0201_033L]  (hidden comment: LMK063BJ224MP-F)
C62  value 10uF  [0402_070]  (hidden comment: CL05A106MP5NUNC)
C63  value 0.22uF  [0201_033L]  (hidden comment: LMK063BJ224MP-F)
C64  value 0.22uF  [0201_033L]  (hidden comment: LMK063BJ224MP-F)
C65  value 10uF  [0402_070]  (hidden comment: CL05A106MP5NUNC)
C66  value 0.22uF  [0201_033L]  (hidden comment: LMK063BJ224MP-F)
C67  value 0.22uF  [0201_033L]  (hidden comment: LMK063BJ224MP-F)
C68  value 0.22uF  [0201_033L]  (hidden comment: LMK063BJ224MP-F)
C69  ValueDisplayed: 0.047uF  [0201_033L]  (hidden comment: GRM033R61C473KE84D)
C70  value 10uF  [0402_070]  (hidden comment: CL05A106MP5NUNC)
C73  value 10uF  [0402_070]  (hidden comment: CL05A106MP5NUNC)
C74  value 2.2uF  [0201L]  (hidden comment: CL03A225MQ3CRNC)
C75  value 0.22uF  [0201_033L]  (hidden comment: LMK063BJ224MP-F)
C76  value 0.22uF  [0201_033L]  (hidden comment: LMK063BJ224MP-F)
C78  value 10uF  [0402_070]  (hidden comment: CL05A106MP5NUNC)
C79  value 2.2uF  [0201L]  (hidden comment: CL03A225MQ3CRNC)
C80  value 0.22uF  [0201_033L]  (hidden comment: LMK063BJ224MP-F)
C81  value 0.22uF  [0201_033L]  (hidden comment: LMK063BJ224MP-F)
C82  value 10uF  [0402_070]  (hidden comment: CL05A106MP5NUNC)
C83  value 2.2uF  [0201L]  (hidden comment: CL03A225MQ3CRNC)
C84  value 0.22uF  [0201_033L]  (hidden comment: LMK063BJ224MP-F)
C85  value 0.22uF  [0201_033L]  (hidden comment: LMK063BJ224MP-F)
C87  value 0.22uF  [0201_033L]  (hidden comment: LMK063BJ224MP-F)
C88  value 0.22uF  [0201_033L]  (hidden comment: LMK063BJ224MP-F)
C89  ValueDisplayed: 1µF  [0402L]  (hidden comment: CGB2A1X6S0J105K033BC)
C90  ValueDisplayed: 1µF  [0402L]  (hidden comment: CGB2A1X6S0J105K033BC)
C91  Cap_F: 100nF  [FP-GRM033R6YA104KE14D_0201 (0603 Metric)-IPC_C]  (hidden comment: GRM033R6YA104KE14D)
C92  Cap_F: 100nF  [FP-GRM033R6YA104KE14D_0201 (0603 Metric)-IPC_C]  (hidden comment: GRM033R6YA104KE14D)
C94  value 0.22uF  [0201_033L]  (hidden comment: LMK063BJ224MP-F)
C95  value 0.22uF  [0201_033L]  (hidden comment: LMK063BJ224MP-F)
C96  value 0.22uF  [0201_033L]  (hidden comment: LMK063BJ224MP-F)
C97  value 0.22uF  [0201_033L]  (hidden comment: LMK063BJ224MP-F)
C98  value 0.22uF  [0201_033L]  (hidden comment: LMK063BJ224MP-F)
C102  value 2.2uF  [0201L]  (hidden comment: CL03A225MQ3CRNC)
C103  value 2.2uF  [0201L]  (hidden comment: CL03A225MQ3CRNC)
FL6  BLM15PD300SZ1D  [0402L]  (value not drawn)
FL7  BLM15PD300SZ1D  [0402L]  (value not drawn)
TP11  TESTPOINT  [TP_25MIL-SMT]  (value not drawn)  (no BOM)
U2  XI6843ARQGALP  [ALP0180A]  (parts C,D of 4)

### Nets
AR_1P0_RF1: C78.1 C79.1 C80.1 C81.1 U2.J16(VIN_13RF1) U2.J17(VIN_13RF1) U2.J18(VIN_13RF1)
AR_1P0_RF2: C82.1 C83.1 C84.1 C85.1 U2.H16(VIN_13RF2) U2.H17(VIN_13RF2) U2.H18(VIN_13RF2)
AR_1P2: FL6.1
AR_1V4_APLL: C90.1 U2.A10(VOUT_14APLL)
AR_1V4_SYNTH: C89.1 U2.A9(VOUT_14SYNTH)
AR_VBGAP: C69.1
AR_VOUT_PA: C70.1 C73.1 C74.1 C75.1 C76.1 U2.G16(VOUT_PA) U2.G17(VOUT_PA) U2.G18(VOUT_PA)
BB_1V8: C55.1 C56.1 C57.1 C58.1 U2.M16(VIN_18BB) U2.M17(VIN_18BB) U2.M18(VIN_18BB)
GND: C55.2 C56.2 C57.2 C58.2 C59.2 C60.2 C61.2 C62.2 C63.2 C64.2 C65.2 C66.2 C67.2 C68.2 C69.2 C70.2 C73.2 C74.2 C75.2 C76.2 C78.2 C79.2 C80.2 C81.2 C82.2 C83.2 C84.2 C85.2 C87.2 C88.2 C89.2 C90.2 C91.2 C92.2 C94.2 C95.2 C96.2 C97.2 C98.2 C102.2 C103.2 U2.A1(VSS) U2.A2(VSS) U2.A6(VSSA) U2.A8(VSSA) U2.A11(VSSA) U2.A13(VSSA) U2.A15(VSSA) U2.A17(VSSA) U2.A18(VSSA) U2.B6(VSSA) U2.B8(VSSA) U2.B9(VSSA) U2.B10(VSSA) U2.B11(VSSA) U2.B12(VSSA) U2.B13(VSSA) U2.B14(VSSA) U2.B15(VSSA) U2.B16(VSSA) U2.B17(VSSA) U2.B18(VSSA) U2.C6(VSSA) U2.C7(VSSA) U2.C8(VSSA) U2.C12(VSSA) U2.C13(VSSA) U2.C14(VSSA) U2.C16(VSSA) U2.C17(VSSA) U2.D16(VSSA) U2.D17(VSSA) U2.D18(VSSA) U2.E3(VSS) U2.E16(VSSA) U2.E17(VSSA) U2.E18(VSSA) U2.F3(VSS) U2.F16(VSSA) U2.F17(VSSA) U2.F18(VSSA) U2.K16(VSSA) U2.K17(VSSA) U2.K18(VSSA) U2.L16(VSSA) U2.L17(VSSA) U2.L18(VSSA) U2.N3(VSS) U2.N16(VSSA) U2.N17(VSSA) U2.N18(VSSA) U2.P3(VSS) U2.P16(VSSA) U2.R3(VSS) U2.R16(VSSA) U2.R17(VSSA) U2.T4(VSS) U2.T5(VSS) U2.T6(VSS) U2.T7(VSS) U2.T8(VSS) U2.T9(VSS) U2.T10(VSS) U2.T11(VSS) U2.T12(VSS) U2.T13(VSS) U2.T14(VSS) U2.T15(VSS) U2.T16(VSS) U2.T17(VSSA) U2.U1(VSS) U2.U17(VSSA) U2.U18(VSSA) U2.V1(VSS) U2.V17(VSSA) U2.V18(VSSA)
PMIC_1V2_FILTERED: C91.1 C92.1 C94.1 C95.1 C96.1 C97.1 C98.1 C103.1 FL6.2 U2.A5(VIN_SRAM_3) U2.C1(VNWA_3) U2.E1(VDDIN) U2.J1(VDDIN) U2.V4(VDDIN) U2.V6(VIN_SRAM_2) U2.V7(VNWA_2) U2.V8(VDDIN) U2.V12(VIN_SRAM_1) U2.V14(VNWA_1) U2.V15(VDDIN)
PMICOUT_3V3: C87.1 C88.1 C102.1 U2.H1(VIOIN_2) U2.V9(VIOIN_1)
VCLK_1V8: C65.1 C66.1 C67.1 C68.1 FL7.2 U2.C15(VIN_18CLK) U2.C18(VIN_18CLK)
VCO_1V8: C62.1 C63.1 C64.1 FL7.1 U2.A12(VIN_18VCO) U2.C11(VIN_18VCO)
VIOIN_1V8: C59.1 C60.1 C61.1 U2.B1(VIOIN_18_3) U2.F1(VIOIN_18_3) U2.K1(VIOIN_18_2) U2.U2(VIOIN_18DIFF) U2.V11(VIOIN_18_1)
NetTP11_1: TP11.1 U2.V2(VPP)

### Notes on the sheet
- AOP POWER
- DECOUPLING CAPS
- BB SUPPLY
- DIFF SUPPLY
- 1P8V IO SUPPLY
- VCOLDO SUPPLY
- VCLK SUPPLY
- RF1 SUPPLY
- RF2 SUPPLY
- 3V3IO SUPPLY
- VNWA SUPPLY
- SRAM SUPPLY
- DIG SUPPLY
- Drawn By:
- SVN Rev:
- Number:
- TID #:
- Orderable:
- Rev:
- Sheet Title:
- File:
- Project Title:
- Designed for:
- Assembly Variant:
- Mod. Date:
- Sheet:
- Size:
- of
- B
- http://www.ti.com
- Texas Instruments and/or its licensors do not warrant the accuracy or completeness of this specification or any information contained therein. Texas Instruments and/or its licensors do not warrant that this design will meet the specifications, will be suitable for your application or fit for any particular purpose, or will operate in an implementation. Texas Instruments and/or its licensors do not warrant that the design is production worthy. You should completely validate and test your design implementation to confirm the system functionality for your application.
- Engineer:
- Contact:
- © Texas Instruments

### Library data of the parts
C55 C59 C62 C65 C70 C73 C78 C82 = CMP-0006339-4: CAP, CERM, 10 uF, 10 V, +/- 20%, X5R, 0402; Manufacturer: Samsung Electro-Mechanics; AEC Category: Q200; AEC Qualified: N; Cap_Case: 0402; Cap_F: 10µF; SizeArea_mm2: 0.5; SizeAreaWB_mm2: 3; SizeX_mm: 1; SizeZ_mm: 0.6; TaMax_C: 85°C; TaMin_C: -55°C; U/M: EA; Value1: Unknown; Value2: 10V; RoHS: Y; AEC Grade: N/A; ComponentLink1Description: Datasheet link; ComponentLink1URL: http://www.samsungsem.com/kr/support/product-search/mlcc/__icsFiles/afieldfile/2018/06/21/CL05A106MP5NUNC.pdf; CompType: Capacitor; MountType: SMT; PackageReference: 0402; PartNumber: CL05A106MP5NUNC; Polarized: N; SizeY_mm: 0.5; Technology: Ceramic; TempCo: X5R; Tolerance_%: 20%; ValueDisplayed: 10uF; VDC_V: 10V
C56-C58 C60 C61 C63 C64 C66-C68 C75 C76 C80 C81 C84 C85 C87 C88 C94-C98 = CMP-0009781-1: CAP, CERM, 0.22 uF, 10 V, +/- 20%, X5R, 0201; Manufacturer: Taiyo Yuden; AEC Category: Q200; AEC Qualified: N; Cap_Case: 0201; Cap_F: 220nF; SizeArea_mm2: 0.18; SizeAreaWB_mm2: 2.08; SizeX_mm: 0.6; SizeY_mm: 0.3; SizeZ_mm: 0.33; TaMax_C: 85°C; TaMin_C: -55°C; U/M: EA; Value1: Unknown; Value2: 10V; RoHS: Y; AEC Grade: N/A; ComponentLink1Description: Datasheet link; ComponentLink1URL: http://www.yuden.co.jp/productdata/catalog/en/mlcc_all_e.pdf; CompType: Capacitor; LatestRevisionDate: 2017-03-09; MountType: SMT; PackageReference: 0201; PartNumber: LMK063BJ224MP-F; Polarized: N; Published: 2008-06-19; Publisher: Texas Instruments; Supplier 1: Digi-Key; Supplier 2: Newark; Supplier 3: Mouser; Supplier Part Number 1: 587-2483-1-ND; Supplier Part Number 2: 48T3327; Supplier Part Number 3: 963-LMK063BJ224MP-F; Technology: Ceramic; TempCo: X5R; Tolerance_%: 20%; ValueDisplayed: 0.22uF; VDC_V: 10V
C69 = CMP-0009718-2: CAP, CERM, 0.047 uF, 16 V, +/- 10%, X5R, 0201; Manufacturer: MuRata; TaMin_C: -55°C; Polarized: N; SizeAreaWB_mm2: 2.08; Value1: Unknown; U/M: EA; TaMax_C: 85°C; SizeZ_mm: 0.33; SizeX_mm: 0.6; SizeY_mm: 0.3; Cap_Case: 0201; Value2: 16V; SizeArea_mm2: 0.18; Cap_F: 47nF; AEC Category: Q200; Supplier Part Number 2: 81-GRM033R61C473KE4D; Publisher: Texas Instruments; Supplier 2: Mouser; TempCo: X5R; Published: 2008-06-19; RoHS: Y; MountType: SMT; Value: 0.047uF; Supplier 1: Digi-Key; PackageReference: 0201; Tolerance_%: 10%; CompType: Capacitor; LatestRevisionDate: 2017-03-09; PartNumber: GRM033R61C473KE84D; AEC Qualified: N; VDC_V: 16V; ComponentLink1Description: Datasheet link; AEC Grade: N/A; Supplier Part Number 1: 490-7227-1-ND; Technology: Ceramic; ComponentLink1URL: http://search.murata.co.jp/Ceramy/image/img/A01X/G101/ENG/GRM033R61C473KE84-01.pdf
C74 C79 C83 C102 C103 = CMP-0009657-3: CAP, CERM, 2.2 uF, 6.3 V, +/- 20%, X5R, 0201; Manufacturer: Samsung Electro-Mechanics; AEC Category: Q200; Cap_Case: 0201; Cap_F: 2.2µF; Polarized: N; SizeArea_mm2: 0.18; SizeAreaWB_mm2: 2.08; SizeX_mm: 0.6; SizeY_mm: 0.3; SizeZ_mm: 0.26; TaMax_C: 85°C; TaMin_C: -55°C; U/M: EA; Value1: Unknown; Value2: 6.3V; RoHS: Y; AEC Qualified: ?; ComponentLink1Description: Datasheet link; ComponentLink1URL: http://www.samsungsem.com/servlet/FileDownload?type=spec&file=CL03A225MQ3CRNC.pdf; CompType: Capacitor; MountType: SMT; PackageReference: 0201; PartNumber: CL03A225MQ3CRNC; Technology: Ceramic; TempCo: X5R; Tolerance_%: 20%; ValueDisplayed: 2.2uF; VDC_V: 6.3V; LatestRevisionDate: 2017-03-09; Published: 2008-06-19; Publisher: Texas Instruments
C89 C90 = CMP-0081763-1: CAP, CERM, 1 µF, 6.3 V,+/- 10%, X6S, 0402; Manufacturer: TDK; TaMin_C: -55°C; Polarized: N; SizeAreaWB_mm2: 3; U/M: EA; Value: 1uF; TaMax_C: 105°C; SizeZ_mm: 0.6; SizeX_mm: 1; SizeY_mm: 0.5; Cap_Case: 0402; Value2: 6.3V; CompType: Capacitor; AEC Category: Q200; ComponentLink1URL: https://product.tdk.com/info/en/catalog/datasheets/mlcc_commercial_lowprofile_en.pdf; Supplier Part Number 2: 810-CGB2A1X6S0J105KC; Supplier 2: Mouser; TempCo: X6S; RoHS: Y; MountType: SMT; Supplier 1: Digi-Key; PackageReference: 0402; Tolerance_%: 10%; SizeArea_mm2: 0.5; PartNumber: CGB2A1X6S0J105K033BC; AEC Qualified: N; Cap_F: 1µF; VDC_V: 6.3V; ComponentLink1Description: Datasheet link; AEC Grade: N/A; Supplier Part Number 1: 445-13189-1-ND; Technology: Ceramic
C91 C92 = CMP-0086440-1: as C130 on sheet PROC091F_AOP_IO; RoHS: TRUE; ComponentLink1Description: Datasheet; ComponentLink1URL: https://search.murata.co.jp/Ceramy/image/img/A01X/G101/ENG/GRM033R6YA104KE14-01.pdf; PackageReference: 0201 (0603 Metric); PartNumber: GRM033R6YA104KE14D; Tolerance_%: 10%; VDC_V: 35V
FL6 FL7 = CMP-0078934-1: Inductor, Ferrite Bead, Ferrite, 2.2 A, 0.035 ohm, AEC-Q200 Grade 1, SMD; Manufacturer: MuRata; AEC Category: Q200; AEC Grade: 1; AEC Qualified: Y; DCR_ohm: 0.035; Imax_A: 2.2A; SizeArea_mm2: 0.5; SizeAreaWB_mm2: 3; SizeZ_mm: 0.6; RoHS: Y; ComponentLink1Description: Datasheet link; ComponentLink1URL: https://www.murata.com/en-us/products/productdata/8796748677150/QNFA9118.pdf; CompType: Inductor; LatestRevisionDate: 2017-12-07; Material: Ferrite; MountType: SMT; PackageReference: 0402; PartNumber: BLM15PD300SZ1D; Published: 2008-06-26; Publisher: Texas Instruments; SizeX_mm: 1; SizeY_mm: 0.5; Supplier 1: Digi-Key; Supplier 2: Mouser; Supplier Part Number 1: 490-16506-1-ND; Supplier Part Number 2: 81-BLM15PD300SZ1D; Technology: Ferrite Bead; Value1: 0.035 ohm; Value2: 2.2A
TP11 = CMP-0078143-3: TEST POINT.  No entry in BOM.; CompType: Testpoint; Manufacturer: N/A; PackageReference: N/A; PartNumber: N/A; Library Reference: TESTPOINT
U2 = CMP-0860942-2: as U2 on sheet PROC091F_AOP_IO; MountType: SMT; ComponentLink2URL: http://www.ti.com/product/xi6843arqg; Alternate Manufacturer: Texas Instruments; ComponentLink2Description: Product Folder; ComponentLink3Description: Online Datasheet; PackageReference: ALP0180A; ComponentLink1URL: http://www.ti.com/lit/ds/symlink/xi6843arqg.pdf; PartNumber: XI6843ARQGALP; PackageDescription: BGA-180; ComponentLink1Description: Datasheet Link; ComponentLink3URL: http://www.ti.com/product/xi6843arqg/datasheet; SizeY_mm: 15